# EAGLE design gaius (EAGLE 7.5.0)
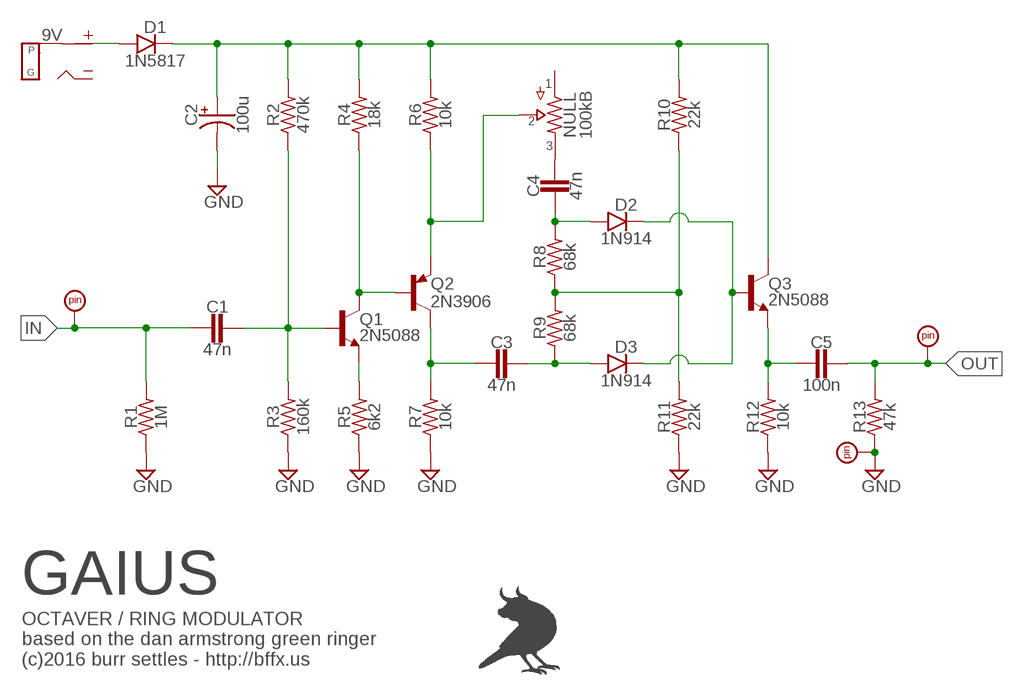
[diagram p0: schematic, sheet 1]

## Parts
9V  DC_MONO  [DC]
C1  47n  CER/FILM2  [050X030_025_2]
C2  100u  0501  [050_020_1]
C3  47n  CER/FILM2  [050X030_025_2]
C4  47n  CER/FILM2  [050X030_025_2]
C5  100n  CER/FILM2  [050X030_025_2]
D1  1N5817  DO41.3  [DO41-3]
D2  1N914  DO35.2  [DO35-2]
D3  1N914  DO35.2  [DO35-2]
GND  PADRND  [ROUND]
IN  PADSQR  [SQUARE]
NULL  100kB  POTSTRIM  [2262_TRIM]
OUT  PADSQR  [SQUARE]
Q1  2N5088  [TO92-]
Q2  2N3906  2N3906-  [TO92-]
Q3  2N5088  [TO92-]
R1  1M  R_.3B  [R0207/3]
R2  470k  R_.3B  [R0207/3]
R3  160k  R_.3B  [R0207/3]
R4  18k  R_.3B  [R0207/3]
R5  6k2  R_.3B  [R0207/3]
R6  10k  R_.3B  [R0207/3]
R7  10k  R_.3B  [R0207/3]
R8  68k  R_.3B  [R0207/3]
R9  68k  R_.3B  [R0207/3]
R10  22k  R_.3B  [R0207/3]
R11  22k  R_.3B  [R0207/3]
R12  10k  R_.3B  [R0207/3]
R13  47k  R_.3B  [R0207/3]

## Nets
GND: C2.- GND.1 R1.1 R3.1 R5.1 R7.1 R11.1 R12.1 R13.1
IN: C1.2 IN.1 R1.2
N$1: Q1.1(C) Q2.2(B) R4.1
N$2: Q1.3(E) R5.2
N$3: C1.1 Q1.2(B) R2.1 R3.2
N$4: C4.2 D2.A R8.2
N$5: NULL.2 Q2.3(E) R6.1
N$6: R8.1 R9.2 R10.1 R11.2
N$7: C4.1 NULL.3
N$8: C3.2 Q2.1(C) R7.2
N$9: C3.1 D3.A R9.1
N$10: C5.2 Q3.3(E) R12.2
N$11: D2.C D3.C Q3.2(B)
N$12: C2.+ D1.C Q3.1(C) R2.2 R4.2 R6.2 R10.2
N$13: 9V.T(TIP) D1.A
OUT: C5.1 OUT.1 R13.2
Unconnected: 9V.S(SLEEVE) NULL.1

## Notes on the sheet
- GAIUS
- OCTAVER / RING MODULATOR
  based on the dan armstrong green ringer
  (c)2016 burr settles - http://bffx.us

## Library data of the parts
9V = jacks:DC_MONO
C1 C3-C5 = capacitors-film:CER/FILM: 47 - 120pF Xicon Ceramic Disc 2.5mm lead spacing
C2 = capacitors-elec:050: 0.22 - 100uF Xicon values at Mouser.com: 10V: 10 - 100uF; 16V: 2.2 - 47uF; 25V: 0.47 - 47uF; 50V: 0.22 - 22uF
D1 = diodes:DO41: DO-41 Package Diodes: 1N4001 - 1N40019 Zener Diodes: 1N4728 - 1N4764
D2 D3 = diodes:DO35: DO-35 Package Diodes: 1N914
GND IN OUT = supply pins:PAD
NULL = potentiometers:POTS
Q1 Q3 = transistors:2N5088: NPN Transistor
Q2 = transistors:2N3906: PNP Transistor
R1-R13 = resistors:R_

## Board
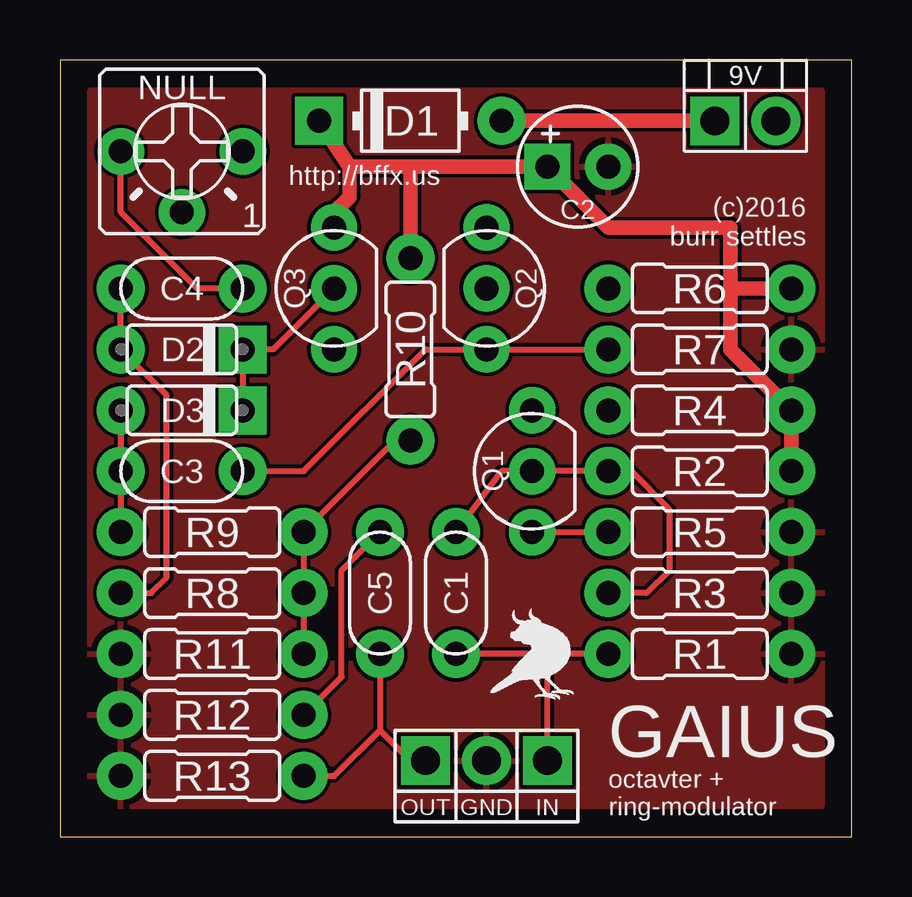
[diagram p1: board, top side]
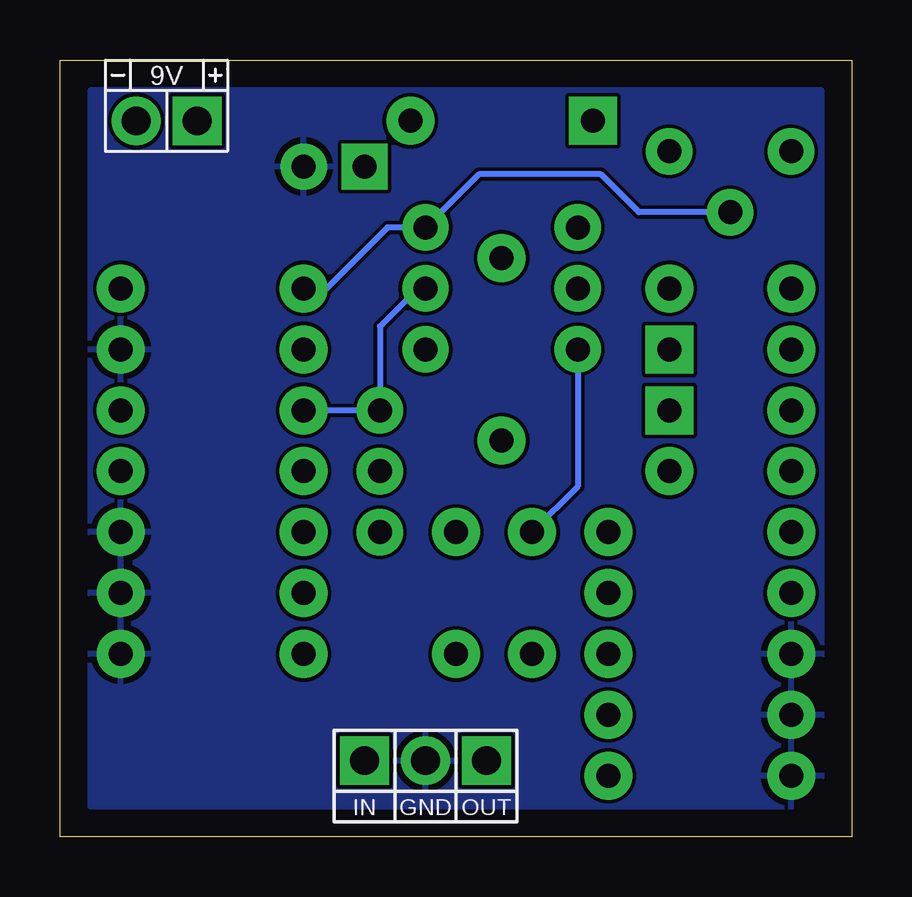
[diagram p2: board, bottom side, seen from below]

Size 33.02 x 32.38 mm. Coordinates in mm from the lower left corner, seen from the top.
Outline: 0,0 33.02,0 33.02,32.38 0,32.38 0,0
Copper layers (1*16): Top 0.0356mm / dielectric 1.5011mm / Bottom 0.0356mm
Design rules "oshpark-2layer": minimum track width 6mil, minimum drill 13mil, track to track 6mil, track to pad 6mil, pad to pad 6mil, via to via 6mil, smd to smd 6mil, copper to edge 15mil, drill to drill 6mil, minimum pad ring 7mil, minimum via ring 7mil, stop-mask expansion 2.5mil, vias tented up to drill 0mil, thermal gap 10mil

### Footprints (pad centres in the part's own frame; a part is rotated, then mirrored left to right if it is on the bottom)
DC = drill 1.2 pad 2.032: S -1.27,0 | drill 1.2 pad 2.032 square: T 1.27,0
050X030_025_2 = drill 1 pad 2: 1 -2.54,0; 2 2.54,0
050_020_1 = drill 1 pad 1.93 square: + -1.27,0 | drill 1 pad 1.93: - 1.27,0
DO41-3 = drill 1 pad 2: A 3.81,0 | drill 1 pad 2 square: C -3.81,0
DO35-2 = drill 1 pad 2: A 2.54,0 | drill 1 pad 2 square: C -2.54,0
ROUND = drill 1.2 pad 2.032: 1 0,0
SQUARE = drill 1.2 pad 2.032 square: 1 0,0
2262_TRIM = drill 1 pad 1.93: 1 -2.54,0; 2 0,2.54; 3 2.54,0
TO92- = drill 1 pad 1.93: 1 2.54,0; 2 0,0; 3 -2.54,0
R0207/3 = drill 1 pad 2: 1 -3.81,0; 2 3.81,0

### Placement (x,y rotation side)
9V  28.57,29.84 0 bottom
C1  16.51,10.16 270 top
C2  21.59,27.94 0 top
C3  5.08,15.24 0 top
C4  5.08,22.86 180 top
C5  13.34,10.16 90 top
D1  14.61,29.84 0 top
D2  5.08,20.32 180 top
D3  5.08,17.78 180 top
GND  17.78,3.17 0 top
IN  20.32,3.17 0 top
NULL  5.08,28.57 180 top
OUT  15.24,3.17 0 top
Q1  19.68,15.24 90 top
Q2  17.78,22.86 270 top
Q3  11.43,22.86 90 top
R1  26.67,7.62 180 top
R2  26.67,15.24 0 top
R3  26.67,10.16 180 top
R4  26.67,17.78 0 top
R5  26.67,12.7 180 top
R6  26.67,22.86 0 top
R7  26.67,20.32 180 top
R8  6.35,10.16 180 top
R9  6.35,12.7 0 top
R10  14.61,20.32 90 top
R11  6.35,7.62 0 top
R12  6.35,5.08 0 top
R13  6.35,2.54 0 top
U$1  [BF0150]  19.68,7.62 0 top

### Tracks (layer width: path | path; a pad name or v marks a point on that pad's centre or on a via)
GND
  pour Bottom: 1.27,31.11 31.75,31.11 31.75,1.27 1.27,1.27
  pour Top: 1.27,31.11 31.75,31.11 31.75,1.27 1.27,1.27
IN
  Top 0.254: IN.1 20.32,7.62 | 20.32,7.62 C1.2 | R1.2 20.32,7.62
N$1
  Bottom 0.254: Q2.2 18.1,22.86 19.68,21.27 Q1.1 R4.1
N$2
  Top 0.254: Q1.3 R5.2
N$3
  Top 0.254: R3.2 24.45,10.16 25.4,11.11 25.4,13.65 23.81,15.24 R2.1 Q1.2 18.41,15.24 C1.1
N$4
  Top 0.254: R8.2 3.81,10.16 4.45,10.79 4.45,18.41 D2.A C4.2
N$5
  Bottom 0.254: R6.1 21.91,22.86 19.37,25.4 Q2.3 15.56,27.62 10.48,27.62 8.89,26.04 NULL.2
N$6
  Top 0.254: R10.1 13.97,16.51 R9.2 R8.1 R11.2
N$7
  Top 0.254: C4.1 5.71,22.86 2.54,26.04 NULL.3
N$8
  Top 0.254: C3.2 10.16,15.24 15.24,20.32 Q2.1 R7.2
N$9
  Top 0.254: D3.A C3.1 R9.1
N$10
  Top 0.254: R12.2 11.75,6.67 11.75,11.11 C5.2
  Bottom 0.254: Q3.3 11.43,14.61 C5.2
N$11
  Top 0.254: Q3.2 8.89,20.32 D2.C D3.C
N$12
  Top 0.61: R2.2 R4.2 27.94,20.32 27.94,22.86 | D1.C 12.06,27.94 | 12.06,27.94 12.06,26.67 11.43,26.04 Q3.1 | 14.61,27.94 C2.+ 22.86,25.4 27.94,25.4 27.94,22.86 | 14.61,27.94 12.06,27.94 | R10.2 14.61,27.94 | R6.2 27.94,22.86
N$13
  Top 0.61: 9V.T D1.A
OUT
  Top 0.254: C5.1 13.34,4.45 | R13.2 11.43,2.54 13.34,4.45 | OUT.1 14.61,3.17 13.34,4.45

### Text on the board
tNames: http://bffx.us | (c)2016 / burr settles | GAIUS | octavter + / ring-modulator